# Altium schematic sheet CC3000MOD.SchDoc
size A
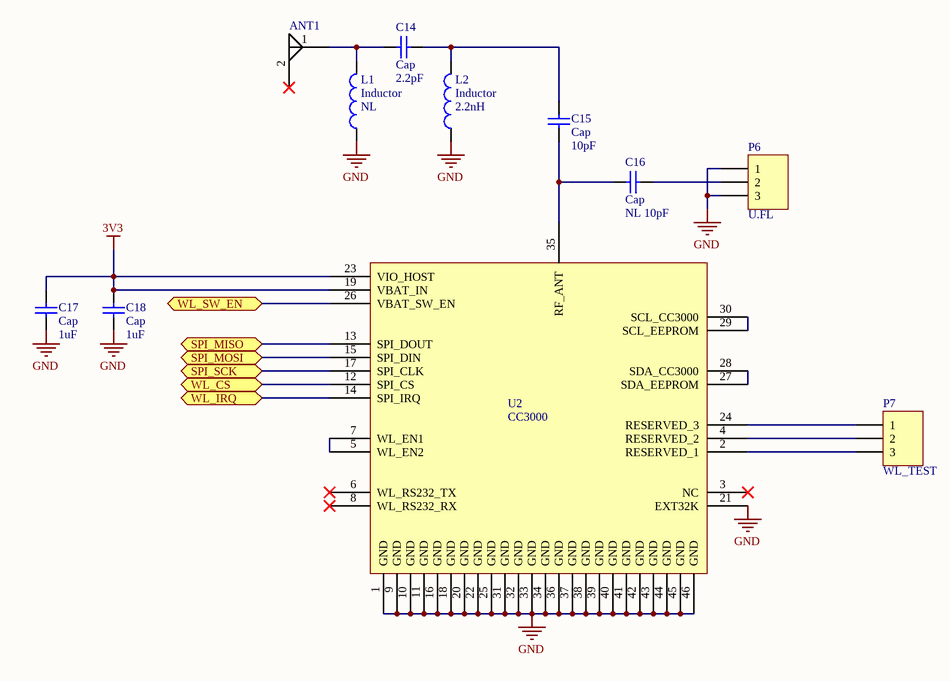
[diagram p0: CC3000MOD.SchDoc]

## Parts
ANT1  ANT-SMT-2  [2500AT44M0400]  (value not drawn)
C14  Cap  value 2.2pF  [0402]
C15  Cap  value 10pF  [0402]
C16  Cap  value NL 10pF  [0402]
C17  Cap  value 1uF  [0402]
C18  Cap  value 1uF  [0402]
L1  Inductor  value NL  [0402]
L2  Inductor  value 2.2nH  [0402]
P6  U.FL  [U.FL-R-SMT-1]
P7  WL_TEST  [HDR1X3]
U2  CC3000  [CC3000]

## Ports
SPI_MISO, SPI_MOSI, SPI_SCK, WL_CS, WL_IRQ, WL_SW_EN

## Nets
3V3: C17.2 C18.2 U2.19(VBAT_IN) U2.23(VIO_HOST)
GND: C17.1 C18.1 L1.1 L2.1 P6.1 P6.3 U2.1(GND) U2.9(GND) U2.10(GND) U2.11(GND) U2.16(GND) U2.18(GND) U2.20(GND) U2.21(EXT32K) U2.22(GND) U2.25(GND) U2.31(GND) U2.32(GND) U2.33(GND) U2.34(GND) U2.36(GND) U2.37(GND) U2.38(GND) U2.39(GND) U2.40(GND) U2.41(GND) U2.42(GND) U2.43(GND) U2.44(GND) U2.45(GND) U2.46(GND)
SPI_MISO: U2.13(SPI_DOUT) ; port SPI_MISO
SPI_MOSI: U2.15(SPI_DIN) ; port SPI_MOSI
SPI_SCK: U2.17(SPI_CLK) ; port SPI_SCK
WL_CS: U2.12(SPI_CS) ; port WL_CS
WL_IRQ: U2.14(SPI_IRQ) ; port WL_IRQ
WL_SW_EN: U2.26(VBAT_SW_EN) ; port WL_SW_EN
NetANT1_1: ANT1.1 C14.1 L1.2
NetC14_2: C14.2 C15.2 L2.2
NetC15_1: C15.1 C16.2 U2.35(RF_ANT)
NetC16_1: C16.1 P6.2
NetP7_1: P7.1 U2.24(RESERVED_3)
NetP7_2: P7.2 U2.4(RESERVED_2)
NetP7_3: P7.3 U2.2(RESERVED_1)
NetU2_5: U2.5(WL_EN2) U2.7(WL_EN1)
NetU2_27: U2.27(SDA_EEPROM) U2.28(SDA_CC3000)
NetU2_29: U2.29(SCL_EEPROM) U2.30(SCL_CC3000)

Not connected (* = marked no-connect by the designer): ANT1 2*; U2 3(NC)* 6(WL_RS232_TX)* 8(WL_RS232_RX)*

## Library data of the parts
C14 = Cap: Capacitor; Substitution: Original part was Walsin 0402N2R2C500LT (0402, NP0, 2.2pF, +/- 0.25pF, 50V, AgNiSn termination); Supplier 1: Digi-Key; Supplier Part Number 1: 490-3091-6-ND
C15 = Cap: Capacitor; Substitution: Original part was Walsin 0402N100J500LT  (0402, NP0, 10pF, +/- 5%, 50V, Ag/Ni/Sn Termination); Supplier 1: Digi-Key; Supplier Part Number 1: 490-1278-6-ND
C16-C18 = Cap: Capacitor; Supplier 1: Digi-Key
  C17 C18: Supplier Part Number 1: 490-1320-6-ND
P6 P7 = Header 3: Header, 3-Pin
  P6: Supplier 1: Digi-Key; Supplier Part Number 1: H11891DKR-ND
U2 = CC3000: CC3000 WLAN Module; Supplier 1: Digi-Key; Supplier Part Number 1: 296-35512-6-ND
ANT1 = ANT-SMT-2: Supplier 1: Digi-Key; Supplier Part Number 1: 712-1403-6-ND
L1 L2 = Inductor
  L2: Supplier 1: Digi-Key; Supplier Part Number 1: 712-1414-6-ND